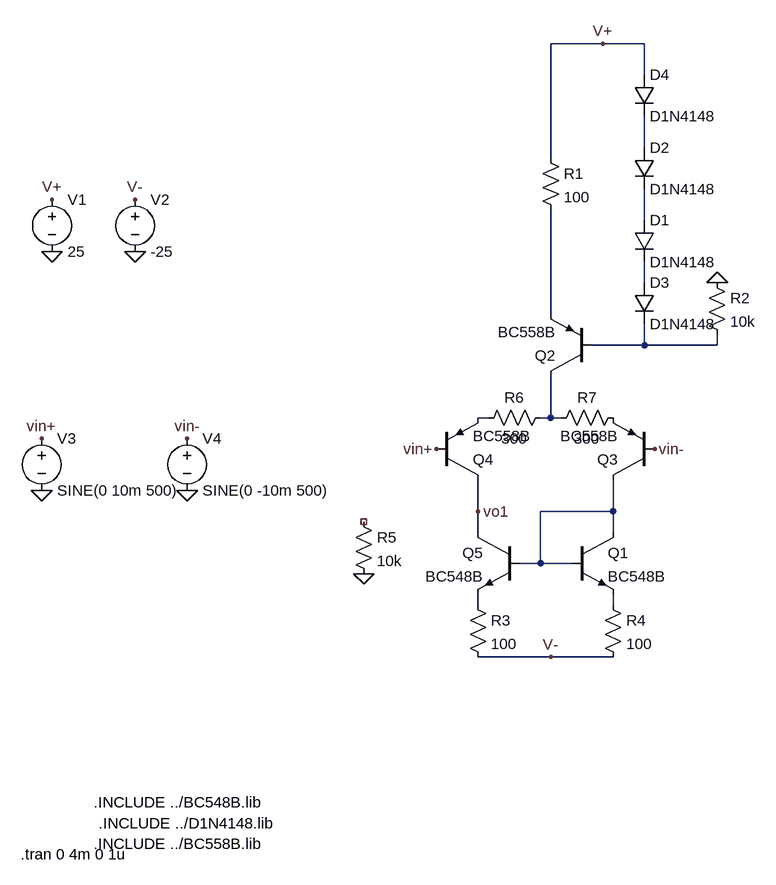
[diagram p0: schematic diferencial.asc]
diferencial.asc, the LTspice schematic file:
Version 4
SHEET 1 3084 1376
WIRE 2464 -1456 2384 -1456
WIRE 2528 -1456 2464 -1456
WIRE 2528 -1408 2528 -1456
WIRE 2528 -1296 2528 -1344
WIRE 2384 -1280 2384 -1456
WIRE 2528 -1184 2528 -1232
WIRE 2528 -1088 2528 -1120
WIRE 2384 -1040 2384 -1200
WIRE 2528 -992 2528 -1024
WIRE 2528 -992 2448 -992
WIRE 2640 -992 2640 -1008
WIRE 2640 -992 2528 -992
WIRE 2288 -880 2272 -880
WIRE 2384 -880 2384 -944
WIRE 2384 -880 2368 -880
WIRE 2400 -880 2384 -880
WIRE 2272 -736 2272 -784
WIRE 2480 -736 2480 -784
WIRE 2480 -736 2368 -736
WIRE 2272 -704 2272 -736
WIRE 2480 -704 2480 -736
WIRE 2368 -656 2368 -736
WIRE 2368 -656 2336 -656
WIRE 2416 -656 2368 -656
WIRE 2272 -592 2272 -608
WIRE 2480 -592 2480 -608
WIRE 2384 -512 2272 -512
WIRE 2480 -512 2384 -512
FLAG 2640 -1088 0
FLAG 1616 -1216 V+
FLAG 2384 -512 V-
FLAG 1744 -1216 V-
FLAG 2208 -832 vin+
FLAG 1600 -848 vin+
FLAG 2544 -832 vin-
FLAG 2272 -736 vo1
FLAG 1744 -1136 0
FLAG 1616 -1136 0
FLAG 1824 -848 vin-
FLAG 1600 -768 0
FLAG 1824 -768 0
FLAG 2096 -640 0
FLAG 2464 -1456 V+
SYMBOL res 2368 -1296 R0
SYMATTR InstName R1
SYMATTR Value 100
SYMBOL res 2624 -1104 R0
SYMATTR InstName R2
SYMATTR Value 10k
SYMBOL npn 2416 -704 R0
SYMATTR InstName Q1
SYMATTR Value BC548B
SYMBOL pnp 2448 -944 R180
SYMATTR InstName Q2
SYMATTR Value BC558B
SYMBOL pnp 2544 -784 R180
SYMATTR InstName Q3
SYMATTR Value BC558B
SYMBOL pnp 2208 -784 M180
SYMATTR InstName Q4
SYMATTR Value BC558B
SYMBOL npn 2336 -704 M0
SYMATTR InstName Q5
SYMATTR Value BC548B
SYMBOL diode 2512 -1184 R0
SYMATTR InstName D1
SYMATTR Value D1N4148
SYMBOL diode 2512 -1088 R0
SYMATTR InstName D3
SYMATTR Value D1N4148
SYMBOL res 2256 -608 R0
SYMATTR InstName R3
SYMATTR Value 100
SYMBOL res 2464 -608 R0
SYMATTR InstName R4
SYMATTR Value 100
SYMBOL voltage 1616 -1232 R0
WINDOW 123 0 0 Left 2
WINDOW 39 0 0 Left 2
SYMATTR InstName V1
SYMATTR Value 25
SYMBOL voltage 1744 -1232 R0
WINDOW 123 0 0 Left 2
WINDOW 39 0 0 Left 2
SYMATTR InstName V2
SYMATTR Value -25
SYMBOL voltage 1600 -864 R0
WINDOW 123 0 0 Left 2
WINDOW 39 0 0 Left 2
SYMATTR InstName V3
SYMATTR Value SINE(0 10m 500)
SYMBOL voltage 1824 -864 R0
WINDOW 123 0 0 Left 2
WINDOW 39 0 0 Left 2
SYMATTR InstName V4
SYMATTR Value SINE(0 -10m 500)
SYMBOL res 2384 -896 R90
WINDOW 0 0 56 VBottom 2
WINDOW 3 32 56 VTop 2
SYMATTR InstName R6
SYMATTR Value 300
SYMBOL res 2496 -896 R90
WINDOW 0 0 56 VBottom 2
WINDOW 3 32 56 VTop 2
SYMATTR InstName R7
SYMATTR Value 300
SYMBOL res 2080 -736 R0
SYMATTR InstName R5
SYMATTR Value 10k
SYMBOL diode 2512 -1296 R0
SYMATTR InstName D2
SYMATTR Value D1N4148
SYMBOL diode 2512 -1408 R0
SYMATTR InstName D4
SYMATTR Value D1N4148
TEXT 1680 -288 Left 2 !.INCLUDE ../BC548B.lib
TEXT 1688 -256 Left 2 !.INCLUDE ../D1N4148.lib
TEXT 1680 -224 Left 2 !.INCLUDE ../BC558B.lib
TEXT 1568 -208 Left 2 !.tran 0 4m 0 1u

The netlist it stands for:
* diferencial.asc
R1 V+ N004 100
R2 0 N005 10k
Q1 N008 N008 N010 0 BC548B
Q2 N007 N005 N004 0 BC558B
Q3 N008 vin- P001 0 BC558B
Q4 vo1 vin+ N006 0 BC558B
Q5 vo1 N008 N009 0 BC548B
D1 N002 N003 D1N4148
D3 N003 N005 D1N4148
R3 N009 V- 100
R4 N010 V- 100
V1 V+ 0 25
V2 V- 0 -25
V3 vin+ 0 SINE(0 10m 500)
V4 vin- 0 SINE(0 -10m 500)
R6 N007 N006 300
R7 P001 N007 300
R5 NC_01 0 10k
D2 N001 N002 D1N4148
D4 V+ N001 D1N4148
.model D D
.lib standard.dio
.model NPN NPN
.model PNP PNP
.lib standard.bjt
.INCLUDE ../BC548B.lib
.INCLUDE ../D1N4148.lib
.INCLUDE ../BC558B.lib
.tran 0 4m 0 1u
.backanno
.end